# EAGLE design openSX70_ALADDIN_V37_20180120 (EAGLE 8.5.1)
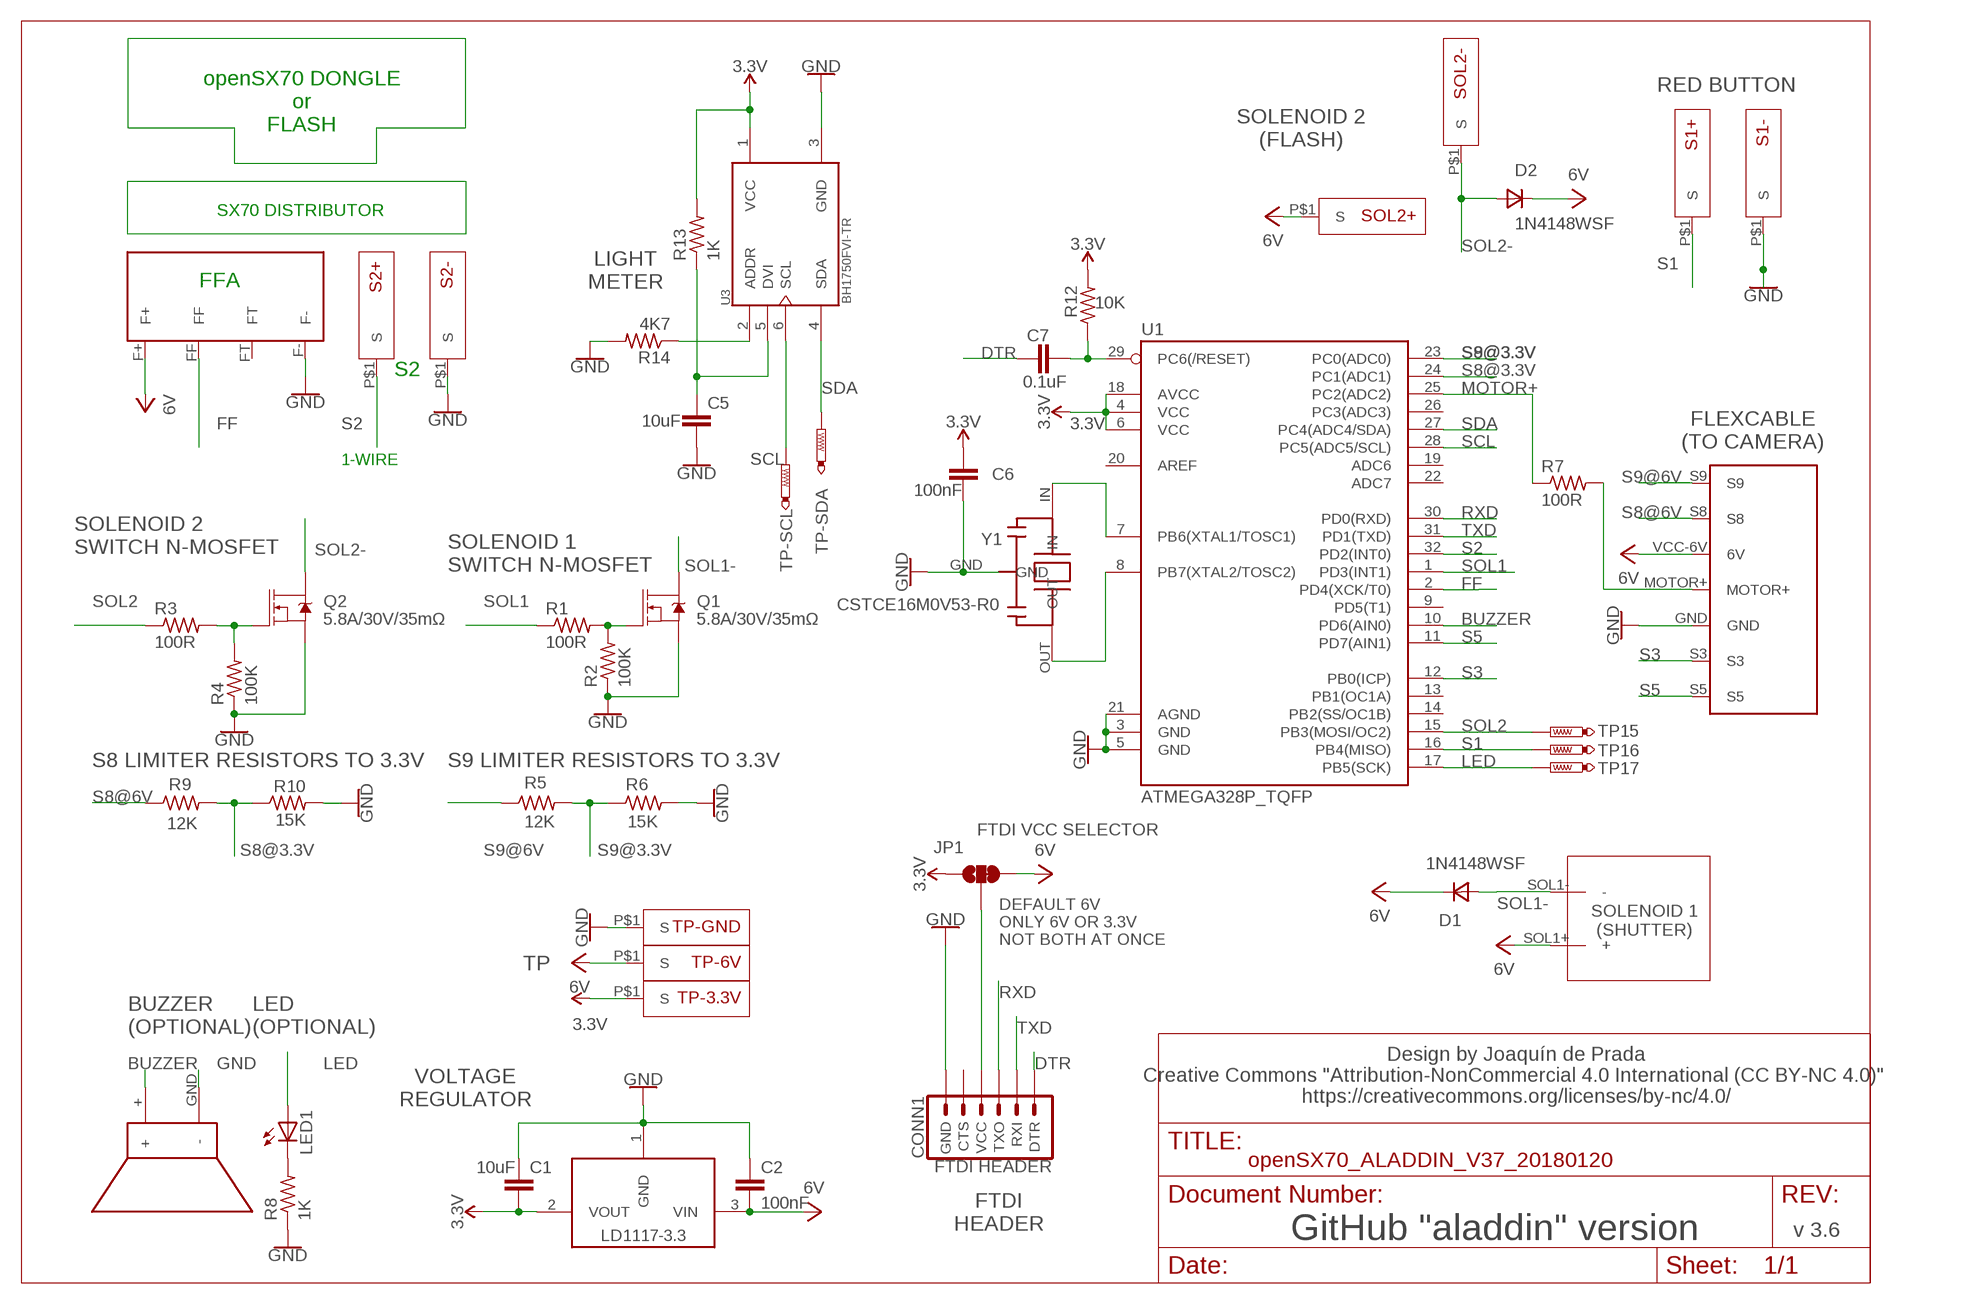
[diagram p0: schematic, sheet 1]

## Parts
BUZZ1  CSET8-5G  [CSET8-5G_PACKAGE]
C1  10uF  10UF-0603-6.3V-20%  [0603]
C2  100nF  C-EUC0603K  [C0603K]
C5  10uF  10UF-0603-6.3V-20%  [0603]
C6  100nF  C-EUC0603  [C0603]
C7  0.1uF  0.1UF-0603-25V-(+80/-20%)  [0603]
CONN1  FTDI HEADER  6_PIN_SERIAL_TARGET  [1X06]
D1  1N4148WSF  DSOD323  [SOD323]
D2  1N4148WSF  DSOD323  [SOD323]
JP1  FTDI VCC SELECTOR  JUMPER-SMT_3_1-NC_TRACE_SILK  [SMT-JUMPER_3_1-NC_TRACE_SILK]
LD11173.3V  LD1117 3.3V  LD1117-3.3  [SOT223]
LED1  LEDCHIPLED_0805  [CHIPLED_0805]
Q1  5.8A/30V/35mΩ  MOSFET-NCH-AO3404A  [SOT23-3]
Q2  5.8A/30V/35mΩ  MOSFET-NCH-AO3404A  [SOT23-3]
R1  100R  R-US_R0603  [R0603]
R2  100K  R-US_R0603  [R0603]
R3  100R  R-US_R0603  [R0603]
R4  100K  R-US_R0603  [R0603]
R5  12K  R-US_R0603  [R0603]
R6  15K  R-US_R0603  [R0603]
R7  100R  R-US_R0603  [R0603]
R8  1K  R-US_R0603  [R0603]
R9  12K  R-US_R0603  [R0603]
R10  15K  R-US_R0603  [R0603]
R12  10K  R-US_R0603  [R0603]
R13  1K  R-US_R0603  [R0603]
R14  4K7  R-US_R0603  [R0603]
S1+  SX70-S-PAD-NEW  [SX70-S-PAD2]
S1-  SX70-S-PAD-NEW  [SX70-S-PAD2]
S2+  SX70-S-PAD-NEW  [SX70-S-PAD2]
S2-  SX70-S-PAD-NEW  [SX70-S-PAD2]
SOL1  SX70-SOLENOID1-2PADS  [SX70-SOLENOID1-2]
SOL2+  SX70-S-PAD-NEW  [SX70-S-PAD2]
SOL2-  SX70-S-PAD-NEW  [SX70-S-PAD2]
TP15  PTR1TP08R  [TP08R]
TP16  PTR1TP08R  [TP08R]
TP17  PTR1TP08R  [TP08R]
TP-3.3V  SX70-S-PAD-NEW  [SX70-S-PAD2]
TP-6V  SX70-S-PAD-NEW  [SX70-S-PAD2]
TP-GND  SX70-S-PAD-NEW  [SX70-S-PAD2]
TP-SCL  PTR1TP08R  [TP08R]
TP-SDA  PTR1TP08R  [TP08R]
U1  ATMEGA328P_TQFP  [TQFP32-08]
U3  BH1750FVI-TR  [SOTFL50P300X75-6N]
U$1  SX70-7-PAD  [SX70-7-PAD]
U$2  FFA  SX70-FFA-PAD  [FFA-PAD-PACKAGE]
Y1  CSTCE16M0V53-R0  [CFP95P160X100-3N]

## Nets
3.3V: C1.2 C6.1 JP1.1 LD11173.3V.2(VOUT) R12.2 R13.2 TP-3.3V.P$1(S) U1.4(VCC) U1.6(VCC) U1.18(AVCC) U3.1(VCC)
6V: C2.2 D1.1(C) D2.1(C) JP1.3 LD11173.3V.3(VIN) SOL1.SOL1+(+) SOL2+.P$1(S) TP-6V.P$1(S) U$1.VCC-6V(6V) U$2.F+
BUZZER: BUZZ1.+ U1.10(PD6(AIN0))
DTR: C7.1 CONN1.1(DTR)
FF: U1.2(PD4(XCK/T0)) U$2.FF
GND: BUZZ1.GND(-) C1.1 C2.1 C5.2 C6.2 CONN1.6(GND) LD11173.3V.1(GND) Q1.2(S) Q2.2(S) R2.1 R4.1 R6.2 R8.1 R10.2 R14.2 S1-.P$1(S) S2-.P$1(S) TP-GND.P$1(S) U1.3(GND) U1.5(GND) U1.21(AGND) U3.3(GND) U$1.GND U$2.F- Y1.GND
LED: LED1.A TP17.TP U1.17(PB5(SCK))
MOTOR+: R7.1 U1.25(PC2(ADC2))
MOTOR-HEADER: R7.2 U$1.MOTOR+
N$1: Q1.1(G) R1.2 R2.2
N$2: C5.1 R13.1 U3.5(DVI)
N$3: Q2.1(G) R3.2 R4.2
N$4: U1.7(PB6(XTAL1/TOSC1)) Y1.IN
N$5: LED1.C R8.2
N$6: U1.8(PB7(XTAL2/TOSC2)) Y1.OUT
N$9: C7.2 R12.1 U1.29(PC6(/RESET))
N$10: R14.1 U3.2(ADDR)
N$27: CONN1.4(VCC) JP1.2
RXD: CONN1.3(TXO) U1.30(PD0(RXD))
S1: S1+.P$1(S) TP16.TP U1.16(PB4(MISO))
S2: S2+.P$1(S) U1.32(PD2(INT0))
S3: U1.12(PB0(ICP)) U$1.S3
S5: U1.11(PD7(AIN1)) U$1.S5
S8@3.3V: R9.2 R10.1 U1.24(PC1(ADC1))
S8@6V: R9.1 U$1.S8
S9@3.3V: R5.2 R6.1 U1.23(PC0(ADC0))
S9@6V: R5.1 U$1.S9
SCL: TP-SCL.TP U1.28(PC5(ADC5/SCL)) U3.6(SCL)
SDA: TP-SDA.TP U1.27(PC4(ADC4/SDA)) U3.4(SDA)
SOL1: R1.1 U1.1(PD3(INT1))
SOL1-: D1.2(A) Q1.3(D) SOL1.SOL1-(-)
SOL2: R3.1 TP15.TP U1.15(PB3(MOSI/OC2))
SOL2-: D2.2(A) Q2.3(D) SOL2-.P$1(S)
TXD: CONN1.2(RXI) U1.31(PD1(TXD))
Unconnected: CONN1.5(CTS) U1.9(PD5(T1)) U1.13(PB1(OC1A)) U1.14(PB2(SS/OC1B)) U1.19(ADC6) U1.20(AREF) U1.22(ADC7) U1.26(PC3(ADC3)) U$2.FT

## Notes on the sheet
- RED BUTTON
- openSX70 DONGLE
  or
  FLASH
- SOLENOID 2
  (FLASH)
- SX70 DISTRIBUTOR
- LIGHT
  METER
- FFA
- S2
- FLEXCABLE
  (TO CAMERA)
- 1-WIRE
- SOLENOID 2
  SWITCH N-MOSFET
- SOLENOID 1
  SWITCH N-MOSFET
- S8 LIMITER RESISTORS TO 3.3V | S9 LIMITER RESISTORS TO 3.3V
- SOLENOID 1
  (SHUTTER)
- TP
- DEFAULT 6V
  ONLY 6V OR 3.3V
  NOT BOTH AT ONCE
- BUZZER
  (OPTIONAL)
- LED
  (OPTIONAL)
- Design by Joaquín de Prada
  Creative Commons "Attribution-NonCommercial 4.0 International (CC BY-NC 4.0)" 
  https://creativecommons.org/licenses/by-nc/4.0/
- VOLTAGE
  REGULATOR
- FTDI
  HEADER
- v 3.6
- GitHub "aladdin" version

## Library data of the parts
BUZZ1 = openSX70:CSET8-5G
C1 C5 = SparkFun-Capacitors:10UF: 10.0µF ceramic capacitors A capacitor is a passive two-terminal electrical component used to store electrical energy temporarily in an electric field.; PROD_ID: CAP-11015
C2 C6 = rcl:C-EU: CAPACITOR, European symbol; SPICEPREFIX: C
C7 = SparkFun-Capacitors:0.1UF: 0.1µF ceramic capacitors A capacitor is a passive two-terminal electrical component used to store electrical energy temporarily in an electric field.; PROD_ID: CAP-00810
CONN1 = SparkFun-Connectors:6_PIN_SERIAL_TARGET: 6-pin header connection for use with the "FTDI BASIC" pinout - TARGET SIDE. Also known as "Arduino Serial Program Header". It is used to mate with our FTDI Basic serial programmers using the Arduino IDE. Note, this device has "TARGET" in the name. It is intended to be used on a design that contains a target micro-controller that you wish to program. The "sister" device, named "CABLE" is inteneded to be used on a design that usually lives on the end of your USB cable and prvides the converter chip (FTDI232 or FTDI231x) to commnicate serial RX/TX. You can populate with some of these: Break Away Headers - Straight (PRT-00116) For reference (or to suit your programming needs) check out these designs: SparkFun FTDI Basic Breakout - 5V (DEV-09716) SparkFun FTDI Basic Breakout - 3.3V (DEV-09873) SparkFun FTDI SmartBasic (DEV-12935) SparkFun Beefy 3 - FTDI Basic Breakout (DEV-13746)
D1 D2 = zetex:D: DIODE; MPN: CDSOD323-T05C; OC_FARNELL: 1824860; OC_NEWARK: 79R6078
JP1 = SparkFun-Jumpers:JUMPER-SMT_3_1-NC_TRACE: Normally closed trace jumper (1 of 2 connections) This jumper has a trace between two pads so it's normally closed (NC). The other connection is normally open (NO). Use a razor knife to open the connection. For best results follow the IPC guidelines for cutting traces: Cutout at least 0.063 mm (0.005 in). Remove all loose material to clean up the cut area. Seal the cut with an approved epoxy. Reapply solder to reclose the connection, or to close the NO connection.
LD11173.3V = openSX70:LD1117-3.3; AVAILABILITY: Unavailable; DESCRIPTION: Sot223/Pkg 1-Amp 5-Volt Low Drop Out Voltage Regulatator; MF: Advanced Monolithic Systems; MP: AMS1117-5.0; PACKAGE: None; PRICE: None
LED1 = led:LED: LED OSRAM: - CHIPLED LG R971, LG N971, LY N971, LG Q971, LY Q971, LO R971, LY R971 LH N974, LH R974 LS Q976, LO Q976, LY Q976 LO Q996 - Hyper CHIPLED LW Q18S LB Q993, LB Q99A, LB R99A - SideLED LS A670, LO A670, LY A670, LG A670, LP A670 LB A673, LV A673, LT A673, LW A673 LH A674 LY A675 LS A676, LA A676, LO A676, LY A676, LW A676 LS A679, LY A679, LG A679 - Hyper Micro SIDELED® LS Y876, LA Y876, LO Y876, LY Y876 LT Y87S - SmartLED LW L88C, LW L88S LB L89C, LB L89S, LG L890 LS L89K, LO L89K, LY L89K LS L896, LA L896, LO L896, LY L896 - TOPLED LS T670, LO T670, LY T670, LG T670, LP T670 LSG T670, LSP T670, LSY T670, LOP T670, LYG T670 LG T671, LOG T671, LSG T671 LB T673, LV T673, LT T673, LW T673 LH T674 LS T676, LA T676, LO T676, LY T676, LB T676, LH T676, LSB T676, LW T676 LB T67C, LV T67C, LT T67C, LS T67K, LO T67K, LY T67K, LW E67C LS E67B, LA E67B, LO E67B, LY E67B, LB E67C, LV E67C, LT E67C LW T67C LS T679, LY T679, LG T679 LS T770, LO T770, LY T770, LG T770, LP T770 LB T773, LV T773, LT T773, LW T773 LH T774 LS E675, LA E675, LY E675, LS T675 LS T776, LA T776, LO T776, LY T776, LB T776 LHGB T686 LT T68C, LB T68C - Hyper Mini TOPLED® LB M676 - Mini TOPLED Santana® LG M470 LS M47K, LO M47K, LY M47K Source: http://www.osram.convergy.de LUXEON: - LUMILED® LXK2-PW12-R00, LXK2-PW12-S00, LXK2-PW14-U00, LXK2-PW14-V00 LXK2-PM12-R00, LXK2-PM12-S00, LXK2-PM14-U00 LXK2-PE12-Q00, LXK2-PE12-R00, LXK2-PE12-S00, LXK2-PE14-T00, LXK2-PE14-U00 LXK2-PB12-K00, LXK2-PB12-L00, LXK2-PB12-M00, LXK2-PB14-N00, LXK2-PB14-P00, LXK2-PB14-Q00 LXK2-PR12-L00, LXK2-PR12-M00, LXK2-PR14-Q00, LXK2-PR14-R00 LXK2-PD12-Q00, LXK2-PD12-R00, LXK2-PD12-S00 LXK2-PH12-R00, LXK2-PH12-S00 LXK2-PL12-P00, LXK2-PL12-Q00, LXK2-PL12-R00 Source: www.luxeon.com KINGBRIGHT: KA-3528ASYC Source: www.kingbright.com
Q1 Q2 = openSX70:MOSFET-NCH: N-channel MOSFETs Voltage controlled devices that allow control of high current outputs. SparkFun Products: SparkFun OpenScale <https://www.sparkfun.com/products/13261> SparkFun Digital Sandbox <https://www.sparkfun.com/products/12651> SparkFun Monster Moto Shield <https://www.sparkfun.com/products/10182> SparkFun MOSFET Power Controller <https://www.sparkfun.com/products/11214>; PROD_ID: TRANS-12988
R1-R10 R12-R14 = resistor:R-US_: RESISTOR, American symbol
S1+ S1- S2+ S2- SOL2+ SOL2- TP-3.3V TP-6V TP-GND = openSX70:SX70-S-PAD-NEW
SOL1 = openSX70:SX70-SOLENOID1-2PADS
TP15-TP17 TP-SCL TP-SDA = testpad:PTR1: TEST PIN
U1 = openSX70:ATMEGA328P_TQFP: Popular 328P in QFP Storefront component: ATmega328 - TQFP (COM-13448) Datasheet SparkFun Products SparkFun RedBoard - Programmed with Arduino (DEV-12757) Arduino Pro Mini 328 - 5V/16MHz (DEV-11113) Arduino Pro Mini 328 - 3.3V/8MHz (DEV-11114) SparkFun OpenLog (DEV-13712) SparkFun MicroView - OLED Arduino Module (DEV-12923) SparkFun Digital Sandbox (DEV-12651) SparkFun PicoBoard (WIG-11888) Arduino Fio (DEV-10116) LilyPad Arduino 328 Main Board (DEV-13342) SparkFun RedStick (DEV-13741) LilyPad MP3 (DEV-11013) LilyPad Arduino SimpleSnap (DEV-10941) SparkFun Stepoko (ROB-13899) SparkFun Geiger Counter (SEN-11345) SparkFun EL Sequencer (COM-12781) Arduino Pro 328 - 5V/16MHz (DEV-10915) CryptoCape (DEV-12773) SparkFun IR Thermometer Evaluation Board - MLX90614 (SEN-10740) SparkFun RedBot Mainboard (ROB-12097) Arduino Pro 328 - 3.3V/8MHz (DEV-10914) SparkFun Block for Intel® Edison - Arduino (DEV-13036) SparkFun Simon Says - Surface Mount Soldering Kit (KIT-10935) SparkFun 7-Segment Serial Display - Red (COM-11441) SparkFun 7-Segment Serial Display - White (COM-11629) SparkFun 7-Segment Serial Display - Yellow (COM-11443) SparkFun 7-Segment Serial Display - Kelly Green (COM-11440) SparkFun 7-Segment Serial Display - Blue (COM-11442) SparkFun OpenSegment Serial Display - 20mm (Blue) (COM-11647) SparkFun OpenSegment Serial Display - 20mm (Green) (COM-11646) SparkFun OpenSegment Serial Display - 20mm (White) (COM-11648) SparkFun OpenSegment Serial Display - 20mm (Red) (COM-11644) SparkFun OpenSegment Serial Display - 20mm (Yellow) (COM-11645) SparkFun OpenSegment Shield (DEV-13190); PROD_ID: IC-09069
U3 = openSX70:BH1750FVI-TR: Light to Digital Ambient Light Sensor Digital O/P 1lux to 65535lux 6-Pin WSOF Embossed T/R; AVAILABILITY: Good; DESCRIPTION: Light to Digital Ambient Light Sensor Digital O/P 1lux to 65535lux 6-Pin WSOF Embossed T/R; MF: Rohm; MP: BH1750FVI-TR; PACKAGE: SMD-6 Rohm; PRICE: 2.38 USD
U$1 = openSX70:SX70-7-PAD
U$2 = openSX70:SX70-FFA-PAD
Y1 = CSTCE16M0V53-R0:CSTCE16M0V53-R0: Ceramic Resonator 16MHz ±0.5% (Tol) ±0.3% (Stability) 15pF 40Ohm 3-Pin CSMD T/R; AVAILABILITY: Good; DESCRIPTION: Ceramic Resonator 16MHz ??0.5% (Tol) ??0.3% (Stability) 15pF 40Ohm 3-Pin CSMD T/R; MF: Murata; MP: CSTCE16M0V53-R0; PACKAGE: SMD-3 Murata; PRICE: 0.28 USD

## Board
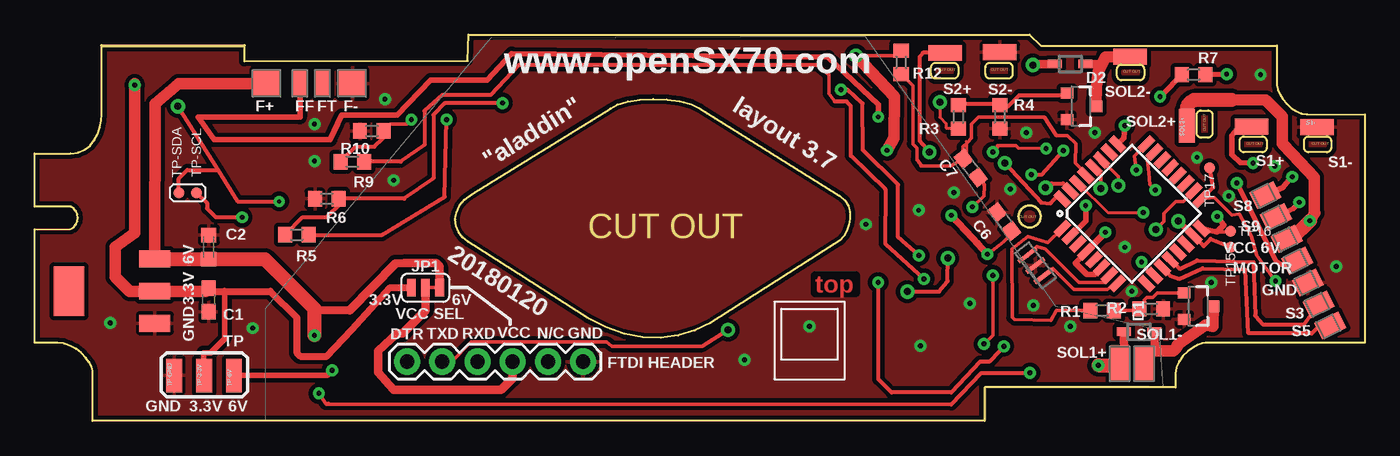
[diagram p1: board, top side]
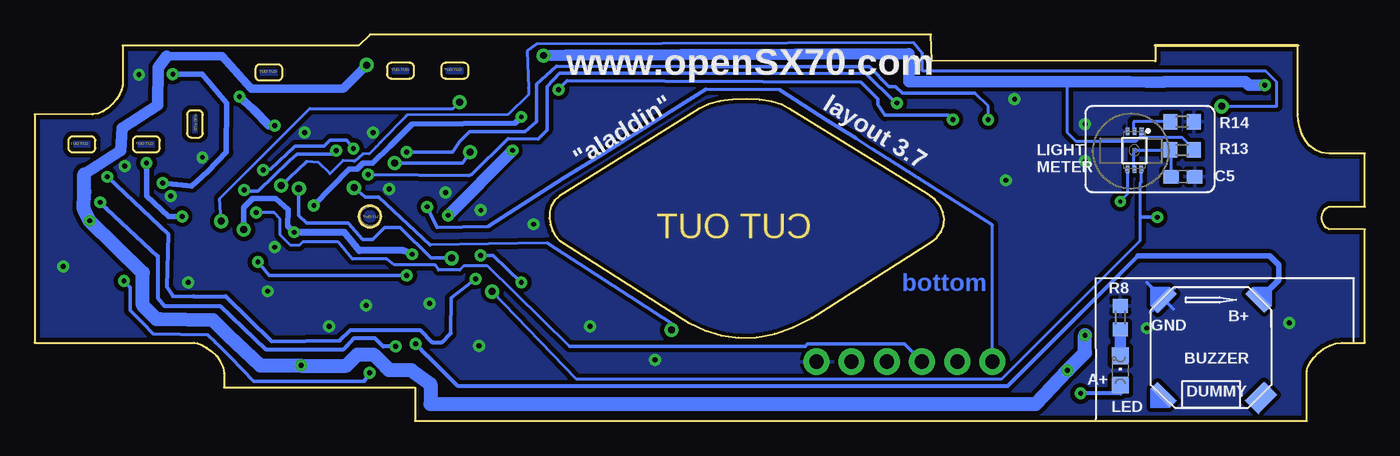
[diagram p2: board, bottom side, seen from below]

Size 95.88 x 27.86 mm. Coordinates in mm from the lower left corner, seen from the top.
Outline: 380 segments
Copper layers (1*16): Top 0.035mm / dielectric 1.5mm / Bottom 0.035mm
Design rules "SparkFun": minimum track width 8mil, minimum drill 20mil, track to track 8mil, track to pad 8mil, pad to pad 8mil, via to via 8mil, smd to smd 8mil, copper to edge 10mil, drill to drill 8mil, minimum pad ring 12mil, minimum via ring 10mil, stop-mask expansion 4mil, vias tented up to drill 25mil, thermal gap 10mil

### Footprints (pad centres in the part's own frame; a part is rotated, then mirrored left to right if it is on the bottom)
CSET8-5G_PACKAGE = smd 1.88 x 0.686 rotated 225: + 3.054,-3.114 | smd 1.88 x 0.686 rotated 45: DUMMY1 -3.786,3.746 | smd 1.9 x 1.3 rotated 135: DUMMY2 -3.99,-3.29 | smd 1.88 x 0.686 rotated 315: GND 3.051,3.742
0603 = smd 1.1 x 1: 1 -0.85,0; 2 0.85,0
C0603K = smd 1.05 x 1.08: 1 -0.875,0; 2 0.875,0
C0603 = smd 1.1 x 1: 1 -0.85,0; 2 0.85,0
1X06 = drill 1.016 pad 1.88: 1 0,0; 2 2.54,0; 3 5.08,0; 4 7.62,0; 5 10.16,0; 6 12.7,0
SOD323 = smd 1 x 0.6: 1 -1.1,0; 2 1.1,0
SMT-JUMPER_3_1-NC_TRACE_SILK = smd 0.635 x 1.27: 1 -1.016,0; 2 0,0; 3 1.016,0
SOT223 = smd 2.235 x 1.219: 1 -3.099,2.311; 2 -3.099,0; 3 -3.099,-2.311 | smd 2.2 x 3.6: 4 3.099,0
CHIPLED_0805 = smd 1.2 x 1.2: A 0,-1.05; C 0,1.05
SOT23-3 = smd 0.8 x 0.9: 1 -0.95,-1; 2 0.95,-1; 3 0,1.1
R0603 = smd 1 x 1.1: 1 -0.85,0; 2 0.85,0
SX70-S-PAD2 = smd 2.413 x 1.143: P$1 0.01,0.087
SX70-SOLENOID1-2 = smd 1.372 x 2.54: SOL1+ -0.826,0.127; SOL1- 0.953,0.127
TP08R = smd 0.8 x 0.8: TP 0,0
TQFP32-08 = smd 1.27 x 0.559: 1 -4.293,2.8; 2 -4.293,2; 3 -4.293,1.2; 4 -4.293,0.4; 5 -4.293,-0.4; 6 -4.293,-1.2; 7 -4.293,-2; 8 -4.293,-2.8; 17 4.293,-2.8; 18 4.293,-2; 19 4.293,-1.2; 20 4.293,-0.4; 21 4.293,0.4; 22 4.293,1.2; 23 4.293,2; 24 4.293,2.8 | smd 0.559 x 1.27: 9 -2.8,-4.293; 10 -2,-4.293; 11 -1.2,-4.293; 12 -0.4,-4.293; 13 0.4,-4.293; 14 1.2,-4.293; 15 2,-4.293; 16 2.8,-4.293; 25 2.8,4.293; 26 2,4.293; 27 1.2,4.293; 28 0.4,4.293; 29 -0.4,4.293; 30 -1.2,4.293; 31 -2,4.293; 32 -2.8,4.293
SOTFL50P300X75-6N = smd 0.55 x 0.3: 1 -1.375,0.525 | smd 0.55 x 0.25: 2 -1.375,0; 3 -1.375,-0.5; 4 1.375,-0.5; 5 1.375,0; 6 1.375,0.5
SX70-7-PAD = smd 1.31 x 1.93 rotated 296: GND 3.404,0.495; MOTOR+ 2.654,2.07; S3 4.204,-1.067; S5 5.016,-2.591; S8 0.356,6.807; S9 1.118,5.232; VCC-6V 1.88,3.658
FFA-PAD-PACKAGE = smd 1.95 x 1.95: F+ -3.277,-0.013; F- 2.87,0 | smd 1.05 x 1.95: FF -0.914,0; FT 0.737,0.025
CFP95P160X100-3N = smd 0.3 x 1.6: GND 0.038,0.175; IN -0.912,0.177; OUT 0.992,0.174

### Placement (x,y rotation side)
BUZZ1  10.77,5.67 90 bottom
C1  12.55,8.72 90 top
C2  12.55,12.53 270 top
C5  13.12,17.61 0 bottom
C6  69.89,14.37 128 top
C7  67.47,18.25 128 top
CONN1  26.83,4.28 0 top
D1  79.6,6.43 0 top
D2  74.65,25.74 0 top
JP1  28.17,9.61 0 top
LD11173.3V  5.56,9.36 180 top
LED1  17.63,3.64 0 bottom
Q1  83.86,8.28 270 top
Q2  75.41,22.69 270 top
R1  76.94,7.96 0 top
R2  80.49,8.09 180 top
R3  66.59,21.93 90 top
R4  69.57,21.93 90 top
R5  18.9,13.42 180 top
R6  21.06,16.02 180 top
R7  83.54,24.98 0 top
R8  17.63,7.45 270 bottom
R9  22.9,18.69 180 top
R10  24.29,20.91 180 top
R12  62.46,25.87 90 top
R13  13.18,19.55 0 bottom
R14  13.18,21.58 0 bottom
S1+  87.72,21.14 0 top
S1-  92.42,21.09 0 top
S2+  65.62,26.46 0 top
S2-  69.56,26.51 0 top
SOL1  79.03,4.05 0 top
SOL2+  83.14,21.28 90 top
SOL2-  78.96,26.19 0 top
TP15  86.21,12.53 0 top
TP16  86.21,13.67 90 top
TP17  84.68,18.25 0 top
TP-3.3V  12.29,3.26 90 top
TP-6V  14.45,3.26 90 top
TP-GND  10.13,3.26 90 top
TP-SCL  11.66,16.47 0 top
TP-SDA  10.39,16.47 0 top
U1  79.09,14.94 45 top
U3  16.61,19.52 270 bottom
U$1  88.37,9.48 0 top
U$2  20.04,24.34 0 top
Y1  71.98,11.13 308 top

### Tracks (layer width: path | path; a pad name or v marks a point on that pad's centre or on a via)
3.3V  (via drill 0.35, 0.5, 0.51)
  Top 0.203: 83.51,16.5 U1.18 | 70.33,13.8 C6.1
  Top 0.254: v80.81,13.8 81.38,14.37 81.38,14.94 82.27,15.83 82.81,15.83 83.51,16.5 | v59.19,26.36 62.1,26.36 R12.2 | 70.56,13.59 70.09,13.16 | 70.09,13.16 69.82,12.91 v68.68,12.02 | 70.09,13.16 70.41,13.48 C6.1 | C6.1
  Top 0.406: U1.4 75.03,11.39 75.86,10.56 76.41,10.56 U1.6 | 13.69,9.36 13.69,5.93 12.67,4.91 12.17,4.91 12.17,3.31 TP-3.3V.P$1
  Top 0.508: LD11173.3V.2 13.69,9.36 16.99,9.36 18.9,7.45 18.9,4.91 19.15,4.66 21.06,4.66 22.83,6.56 25.63,9.61 JP1.1 | U1.4 v77.19,13.6 v77.19,13.61 | v66.08,14.83 67.64,13.15 67.96,12.81 v68.68,12.02
  Top 0.813: 7.21,24.34 v7.21,24.21 7.21,13.55 5.82,12.53 5.82,10.37 6.83,9.36 LD11173.3V.2 12.33,9.36 C1.2 | v61.44,19.52 61.95,20.4 61.99,23.38 v59.19,26.36
  Bottom 0.203: 21.44,24.47 21.44,20.79 20.8,20.15 16.52,20.15 16.2,20.47 | U3.1 16.18,20.8 16.18,20.49 16.2,20.47 | R13.2 12.39,19.67 13.18,20.47 16.2,20.47 | 77.32,13.8 v77.19,13.61
  Bottom 0.406: v77.19,13.61 77.37,13.78 77.65,14.04 77.6,15.26 78.52,16.02 80.17,16.02 80.81,15.39 v80.81,13.8
  Bottom 0.508: v77.19,13.61 73.57,13.61 72.49,12.28 69.3,12.28 v68.68,12.02
  Bottom 0.813: v7.21,24.21 8.36,24.21 8.61,24.47 14.46,24.47 14.48,24.44 14.49,24.44 14.5,24.44 15.11,24.44 15.72,24.44 16.99,24.46 18.09,24.47 21.44,24.47 32.87,24.47 32.87,26.5 57.57,26.37 v59.19,26.36 | v61.44,19.52 v66.08,14.83
6V  (via drill 0.35, 0.51)
  Top 0.406: TP-6V.P$1 21.07,3.27 v21.44,3.64
  Top 0.559: 92.23,15.09 92.26,15
  Top 0.61: U$1.VCC-6V 90.63,13.14 | v71.95,25.68 arc-90 72.01,25.74 D2.1 | JP1.3 29.18,11.13 28.93,11.39 26.64,11.39 26.01,11.36 22.71,7.96 20.23,8.02 | 77.95,4.02 78.54,4.65 D1.1
  Top 0.813: U$2.F+ 10.39,24.34 8.67,22.88 LD11173.3V.3 | 20.17,8.09 20.23,8.02 | 92.23,15.09 92.23,17.56 92.26,17.56 90.65,19.23 89.93,20.01 89.93,21.93 88.75,23.14 86.27,23.17 | 92.26,15 v91.92,14.44
  Top 1.016: 90.63,13.14 v91.92,14.44 | v20.17,6.18 20.17,8.09 16.6,11.66 C2.2 LD11173.3V.3 | v76.68,4.01 77.95,4.02 SOL1.SOL1+ | SOL2+.P$1 83.05,22.42 arc-90 83.79,23.17 86.27,23.17
  Bottom 0.61: v71.95,25.68 73.67,23.96 80.27,23.96 82.36,26.31 86.37,26.31
  Bottom 0.813: 86.84,7.32 87.1,7.32 | 69.7,3.63 70.36,3.65 | 76.68,3.98 v76.68,4.01 | 86.37,26.31 86.97,25.48 87,22.79 89.57,21.13 89.7,19.52 92.3,17.8
  Bottom 1.016: 86.84,7.32 83.03,7.26 81.89,6.12 79.6,3.98 76.68,3.98 73.42,3.98 72.62,4.78 71.46,4.78 70.56,3.89 70.31,3.65 | 87.1,7.32 88.08,8.34 88.08,10.69 v91.92,14.44 92.33,15.26 92.3,16.53 92.3,17.8 | v20.17,6.18 20.17,4.91 v21.44,3.64 23.72,1.23 67.35,1.23 67.35,2.65 68.74,3.65 70.31,3.65 | 70.31,3.65 70.36,3.65
BUZZER  (via drill 0.35)
  Top 0.254: v68.43,5.55 69.06,6.18 v69.06,10.5 | 80.72,10.4 79.79,11.33 v79.79,11.45
  Top 0.305: U1.10 80.72,10.4
  Bottom 0.152: BUZZ1.+ 6.97,9.41
  Bottom 0.254: 79.6,11.27 v79.79,11.45 78.97,10.5 v69.06,10.5
  Bottom 0.305: 16.36,11.9 25.75,2.5 65.36,2.5 67.53,4.67 67.55,4.67 v68.43,5.55
  Bottom 0.406: BUZZ1.+ 6.2,10.18 6.2,11.26 6.83,11.9 16.36,11.9
DTR  (via drill 0.35)
  Top 0.203: C7.1 68.43,17.61 68.43,16.98 68.45,16.97
  Top 0.254: v67.59,15.44 68.42,16.22 68.45,16.97 68.45,17.04 68.02,17.59
  Bottom 0.203: CONN1.1 26.83,14.12 35.5,19.61 36.68,20.4
  Bottom 0.254: 36.68,20.4 38.74,21.68 42.2,23.9 47.5,23.93 55.17,19.12 57.77,17.53 63.19,14.02 66.87,13.96 v67.59,15.44
FF  (via drill 0.35)
  Top 0.406: 19.53,23.94 U$2.FF | v75.76,15.55 75.77,14.44 75.76,14.44 U1.2 | U$2.FF 19.15,24.32 | U$2.FF 19.13,21.9 11.78,21.93 12.93,20.28 21.31,20.28 22.14,22.06 26.14,22.06 28.55,24.6 32.61,24.6 34.39,26.5 57.19,26.25 60.81,22.82 v60.81,21.93
  Bottom 0.406: v60.81,21.93 61.27,21.48 68.68,21.42 69.8,20.28 69.87,20.21 70.27,19.83 71.51,18.6 72.2,18.6 72.66,18.15 73.22,18.15 v75.76,15.55
GND  (via drill 0.35)
  Bottom 0.254: 15.47,7.83 13.69,9.61 BUZZ1.GND 15.72,9.99 13.82,8.09
  other vias: 78.59,12.53 79.09,9.36 84.81,9.99 93.83,11.13 66.27,16.47 71.47,20.79 55.85,6.82 51.15,4.4 15.72,6.69 25.88,17.36 25.25,23.2 20.17,18.75 71.98,8.34 59.92,14.18 67.41,8.47 20.17,21.42 5.43,7.07 76.43,20.79 83.79,19.01 88.37,24.98 89.38,18.37 63.73,15.2 70.33,16.72 86.08,16.21 63.85,5.42 74.65,6.82
  pour Top (isolate 0.305): 91.7,22.11 91.77,22.11 95.88,22.11 95.88,5.64 84.4,5.64 84.15,5.6 83.83,5.47 83.48,5.27 83.11,5.01 82.78,4.68 82.5,4.3 82.31,3.87 82.24,3.4 82.24,2.41 68.47,2.41 68.47,0 4.17,0 4.17,3.6 4.11,3.9 3.94,4.23 3.69,4.56 3.36,4.89 2.98,5.18 2.56,5.42 2.11,5.58 1.66,5.64 0,5.64 0,13.82 2.59,13.84 2.81,13.96 2.98,14.15 3.07,14.39 3.1,14.65 3.07,14.91 2.97,15.15 2.81,15.34 2.59,15.45 0,15.46 0,19.29 2.59,19.29 3.14,19.36 3.6,19.56 3.99,19.87 4.3,20.25 4.53,20.7 4.7,21.17 4.79,21.65 4.82,22.11 4.82,27.07 15.1,27.07 15.1,25.94 31.21,25.85 31.28,27.86 71.71,27.86 72.52,27.07 89.55,27.07 89.55,24.21 89.61,23.9 89.76,23.56 89.97,23.21 90.25,22.87 90.57,22.57 90.93,22.33 91.31,22.17
  pour Bottom (isolate 0.305): 91.7,22.11 91.77,22.11 95.88,22.11 95.88,5.64 84.4,5.64 84.15,5.6 83.83,5.47 83.48,5.27 83.11,5.01 82.78,4.68 82.5,4.3 82.31,3.87 82.24,3.4 82.24,2.41 68.47,2.41 68.47,0 4.17,0 4.17,3.6 4.11,3.9 3.94,4.23 3.69,4.56 3.36,4.89 2.98,5.18 2.56,5.42 2.11,5.58 1.66,5.64 0,5.64 0,13.82 2.59,13.84 2.81,13.96 2.98,14.15 3.07,14.39 3.1,14.65 3.07,14.91 2.97,15.15 2.81,15.34 2.59,15.45 0,15.46 0,19.29 2.59,19.29 3.14,19.36 3.6,19.56 3.99,19.87 4.3,20.25 4.53,20.7 4.7,21.17 4.79,21.65 4.82,22.11 4.82,27.07 15.1,27.07 14.98,25.69 31.08,25.85 31.28,27.86 71.71,27.86 72.52,27.07 89.55,27.07 89.55,24.21 89.61,23.9 89.76,23.56 89.97,23.21 90.25,22.87 90.57,22.57 90.93,22.33 91.31,22.17
LED  (via drill 0.35)
  Top 0.254: U1.17 85.03,16.09 86.3,14.85 86.85,14.92 87.7,13.33 88.11,11.93 v89.45,10.09
  Top 0.305: v20.48,1.98 20.99,1.25 21.18,1.24 66.08,1.19 68.24,3.45 v71.75,3.46 | TP17.TP 84.94,16.83 U1.17
  Bottom 0.254: v71.75,3.46 72.12,2.87 80.1,2.87 81.76,4.57 82.66,5.47 82.88,5.68 83.41,6.22 87.35,6.28 88.11,7.07 89,7.96 89,9.64 v89.45,10.09
  Bottom 0.305: LED1.A 17.6,1.98 v20.48,1.98
MOTOR+  (via drill 0.35)
  Top 0.406: U1.25 78.52,20.4 78.59,21.23 v78.59,21.29 | v81.13,23.39 81.29,23.54 R7.1
  Bottom 0.406: v78.59,21.29 78.97,21.29
  Bottom 0.61: 78.97,21.29 80.11,22.44 v81.13,23.39
MOTOR-HEADER  (via drill 0.35)
  Top 0.406: U$1.MOTOR+ 91.03,11.51 90.14,11.13 89.51,11.51 v86.65,17.17 | v85.92,25.01 R7.2
  Bottom 0.406: v85.92,25.01 83.83,25.01 82.05,22.91 82.08,19.39 83.41,17.99 84.56,16.94 v86.65,17.17
N$1
  Top 0.254: R1.2 79.51,7.96 R2.2 79.98,8.43 79.98,8.72 80.17,8.91 80.6,8.91 80.91,9.23 Q1.1
N$2
  Bottom 0.203: U3.5 16.67,18.25 16.67,19.52 14.13,19.52 R13.1 13.98,19.52 C5.1
N$3
  Top 0.203: 74.3,23.48 Q2.1 | 69.7,22.69 R4.2 69.54,22.85 | 66.68,22.85 R3.2
  Top 0.305: 74.3,23.48 70.97,23.48 70.17,22.69 69.7,22.69 | 69.54,22.85 66.68,22.85
N$4
  Top 0.203: Y1.IN 71.6,11.9 71.54,11.96
  Top 0.254: U1.7 77.06,9.99 75.28,9.99 72.87,12.4 72.26,12.59 71.66,12.07 71.54,11.96 71.53,11.95
N$5
  Bottom 0.813: LED1.C R8.2
N$6
  Top 0.203: Y1.OUT 72.87,10.63 72.88,10.61
  Top 0.254: 77.95,9.93 77.32,9.48 74.9,9.48 73.38,11.01 72.88,10.61 72.75,10.49
  Top 0.305: U1.8 77.95,9.93 77.89,9.93
N$7
  pour Top: 71.72,15.54 71.88,15.53 72.03,15.48 72.17,15.41 72.29,15.31 72.39,15.19 72.46,15.06 72.51,14.91 72.52,14.74 72.51,14.58 72.46,14.43 72.39,14.3 72.29,14.18 72.17,14.08 72.03,14.01 71.88,13.96 71.72,13.94 71.56,13.96 71.41,14.01 71.28,14.08 71.16,14.18 71.06,14.3 70.99,14.43 70.94,14.58 70.92,14.74 70.94,14.91 70.99,15.06 71.06,15.19 71.16,15.31 71.28,15.41 71.41,15.48 71.56,15.53
N$8
  pour Top: 83.76,20.77 83.76,22.06 83.77,22.12 83.79,22.19 83.82,22.24 83.86,22.29 83.91,22.33 83.96,22.36 84.03,22.38 84.09,22.39 84.57,22.39 84.64,22.38 84.7,22.36 84.76,22.33 84.81,22.29 84.85,22.24 84.88,22.19 84.9,22.12 84.9,22.06 84.9,20.77 84.9,20.7 84.88,20.64 84.85,20.58 84.81,20.53 84.76,20.49 84.7,20.46 84.64,20.44 84.57,20.44 84.09,20.44 84.03,20.44 83.96,20.46 83.91,20.49 83.86,20.53 83.82,20.58 83.79,20.64 83.77,20.7
N$9
  Top 0.203: C7.2 67.16,18.88 67.16,20.15 67.22,20.09
  Top 0.254: U1.29 75.86,17.77 75.03,18.6 75.05,20.01 74.44,20.56 73.67,20.56 72.78,21.93 68.05,21.93 67.54,21.42 67.54,20.4 67.22,20.09 66.9,19.77 66.93,18.9 66.01,18.37 63.91,18.4 | R12.1 63.29,24.18 63.29,19.97 63.6,19.67 63.6,18.84
  Top 0.305: 63.6,18.84 63.91,18.4
N$10
  Bottom 0.203: R14.1 16.67,21.58 16.67,20.94 U3.2
N$11
  pour Top: 87.19,20.53 88.48,20.53 88.54,20.52 88.61,20.5 88.66,20.47 88.71,20.43 88.75,20.38 88.78,20.32 88.8,20.26 88.81,20.19 88.81,19.71 88.8,19.65 88.78,19.59 88.75,19.53 88.71,19.48 88.66,19.44 88.61,19.41 88.54,19.39 88.48,19.38 87.19,19.38 87.12,19.39 87.06,19.41 87,19.44 86.95,19.48 86.91,19.53 86.88,19.59 86.86,19.65 86.86,19.71 86.86,20.19 86.86,20.26 86.88,20.32 86.91,20.38 86.95,20.43 87,20.47 87.06,20.5 87.12,20.52
N$12
  pour Top: 91.84,20.53 93.13,20.53 93.2,20.52 93.26,20.5 93.32,20.47 93.37,20.43 93.41,20.38 93.44,20.32 93.46,20.26 93.46,20.19 93.46,19.71 93.46,19.65 93.44,19.59 93.41,19.53 93.37,19.48 93.32,19.44 93.26,19.41 93.2,19.39 93.13,19.38 91.84,19.38 91.78,19.39 91.71,19.41 91.66,19.44 91.61,19.48 91.57,19.53 91.54,19.59 91.52,19.65 91.51,19.71 91.51,20.19 91.52,20.26 91.54,20.32 91.57,20.38 91.61,20.43 91.66,20.47 91.71,20.5 91.78,20.52
N$13
  pour Top: 78.36,25.71 79.65,25.71 79.71,25.7 79.78,25.68 79.83,25.65 79.88,25.61 79.92,25.56 79.95,25.5 79.97,25.44 79.98,25.37 79.98,24.9 79.97,24.83 79.95,24.77 79.92,24.71 79.88,24.66 79.83,24.62 79.78,24.59 79.71,24.57 79.65,24.56 78.36,24.56 78.29,24.57 78.23,24.59 78.17,24.62 78.12,24.66 78.08,24.71 78.05,24.77 78.03,24.83 78.02,24.9 78.02,25.37 78.03,25.44 78.05,25.5 78.08,25.56 78.12,25.61 78.17,25.65 78.23,25.68 78.29,25.7
N$14
  pour Top: 68.87,25.84 70.16,25.84 70.23,25.83 70.29,25.81 70.35,25.78 70.39,25.74 70.44,25.69 70.47,25.63 70.49,25.57 70.49,25.5 70.49,25.03 70.49,24.96 70.47,24.9 70.44,24.84 70.39,24.79 70.35,24.75 70.29,24.72 70.23,24.7 70.16,24.69 68.87,24.69 68.8,24.7 68.74,24.72 68.69,24.75 68.64,24.79 68.6,24.84 68.56,24.9 68.55,24.96 68.54,25.03 68.54,25.5 68.55,25.57 68.56,25.63 68.6,25.69 68.64,25.74 68.69,25.78 68.74,25.81 68.8,25.83
N$16
  pour Top: 64.95,25.84 66.24,25.84 66.31,25.83 66.37,25.81 66.43,25.78 66.48,25.74 66.52,25.69 66.55,25.63 66.57,25.57 66.57,25.5 66.57,25.03 66.57,24.96 66.55,24.9 66.52,24.84 66.48,24.79 66.43,24.75 66.37,24.72 66.31,24.7 66.24,24.69 64.95,24.69 64.89,24.7 64.82,24.72 64.77,24.75 64.72,24.79 64.68,24.84 64.65,24.9 64.63,24.96 64.62,25.03 64.62,25.5 64.63,25.57 64.65,25.63 64.68,25.69 64.72,25.74 64.77,25.78 64.82,25.81 64.89,25.83
N$17
  pour Top: 31.52,16.35 41.5,22.53 42.01,22.82 42.74,23.03 43.62,23.16 44.59,23.21 45.57,23.18 46.5,23.05 47.32,22.84 47.96,22.53 58.05,16.23 58.41,15.9 58.64,15.51 58.77,15.07 58.78,14.61 58.71,14.16 58.56,13.73 58.34,13.34 58.06,13.03 49.78,7.76 48.71,7.05 47.57,6.51 46.38,6.16 45.13,5.99 43.85,6.03 42.53,6.28 41.2,6.75 39.87,7.45 31.22,12.93 30.83,13.23 30.55,13.62 30.37,14.06 30.32,14.55 30.4,15.04 30.62,15.52 30.99,15.97
N$18
  pour Bottom: 71.72,15.54 71.88,15.53 72.03,15.48 72.17,15.41 72.29,15.31 72.39,15.19 72.46,15.06 72.51,14.91 72.52,14.74 72.51,14.58 72.46,14.43 72.39,14.3 72.29,14.18 72.17,14.08 72.03,14.01 71.88,13.96 71.72,13.94 71.56,13.96 71.41,14.01 71.28,14.08 71.16,14.18 71.06,14.3 70.99,14.43 70.94,14.58 70.92,14.74 70.94,14.91 70.99,15.06 71.06,15.19 71.16,15.31 71.28,15.41 71.41,15.48 71.56,15.53
N$19
  pour Bottom: 83.76,20.77 83.76,22.06 83.77,22.12 83.79,22.19 83.82,22.24 83.86,22.29 83.91,22.33 83.96,22.36 84.03,22.38 84.09,22.39 84.57,22.39 84.64,22.38 84.7,22.36 84.76,22.33 84.81,22.29 84.85,22.24 84.88,22.19 84.9,22.12 84.9,22.06 84.9,20.77 84.9,20.7 84.88,20.64 84.85,20.58 84.81,20.53 84.76,20.49 84.7,20.46 84.64,20.44 84.57,20.44 84.09,20.44 84.03,20.44 83.96,20.46 83.91,20.49 83.86,20.53 83.82,20.58 83.79,20.64 83.77,20.7
N$20
  pour Bottom: 87.19,20.53 88.48,20.53 88.54,20.52 88.61,20.5 88.66,20.47 88.71,20.43 88.75,20.38 88.78,20.32 88.8,20.26 88.81,20.19 88.81,19.71 88.8,19.65 88.78,19.59 88.75,19.53 88.71,19.48 88.66,19.44 88.61,19.41 88.54,19.39 88.48,19.38 87.19,19.38 87.12,19.39 87.06,19.41 87,19.44 86.95,19.48 86.91,19.53 86.88,19.59 86.86,19.65 86.86,19.71 86.86,20.19 86.86,20.26 86.88,20.32 86.91,20.38 86.95,20.43 87,20.47 87.06,20.5 87.12,20.52
N$21
  pour Bottom: 91.84,20.53 93.13,20.53 93.2,20.52 93.26,20.5 93.32,20.47 93.37,20.43 93.41,20.38 93.44,20.32 93.46,20.26 93.46,20.19 93.46,19.71 93.46,19.65 93.44,19.59 93.41,19.53 93.37,19.48 93.32,19.44 93.26,19.41 93.2,19.39 93.13,19.38 91.84,19.38 91.78,19.39 91.71,19.41 91.66,19.44 91.61,19.48 91.57,19.53 91.54,19.59 91.52,19.65 91.51,19.71 91.51,20.19 91.52,20.26 91.54,20.32 91.57,20.38 91.61,20.43 91.66,20.47 91.71,20.5 91.78,20.52
N$22
  pour Bottom: 78.36,25.71 79.65,25.71 79.71,25.7 79.78,25.68 79.83,25.65 79.88,25.61 79.92,25.56 79.95,25.5 79.97,25.44 79.98,25.37 79.98,24.9 79.97,24.83 79.95,24.77 79.92,24.71 79.88,24.66 79.83,24.62 79.78,24.59 79.71,24.57 79.65,24.56 78.36,24.56 78.29,24.57 78.23,24.59 78.17,24.62 78.12,24.66 78.08,24.71 78.05,24.77 78.03,24.83 78.02,24.9 78.02,25.37 78.03,25.44 78.05,25.5 78.08,25.56 78.12,25.61 78.17,25.65 78.23,25.68 78.29,25.7
N$23
  pour Bottom: 68.87,25.84 70.16,25.84 70.23,25.83 70.29,25.81 70.35,25.78 70.39,25.74 70.44,25.69 70.47,25.63 70.49,25.57 70.49,25.5 70.49,25.03 70.49,24.96 70.47,24.9 70.44,24.84 70.39,24.79 70.35,24.75 70.29,24.72 70.23,24.7 70.16,24.69 68.87,24.69 68.8,24.7 68.74,24.72 68.69,24.75 68.64,24.79 68.6,24.84 68.56,24.9 68.55,24.96 68.54,25.03 68.54,25.5 68.55,25.57 68.56,25.63 68.6,25.69 68.64,25.74 68.69,25.78 68.74,25.81 68.8,25.83
N$24
  pour Bottom: 64.95,25.84 66.24,25.84 66.31,25.83 66.37,25.81 66.43,25.78 66.48,25.74 66.52,25.69 66.55,25.63 66.57,25.57 66.57,25.5 66.57,25.03 66.57,24.96 66.55,24.9 66.52,24.84 66.48,24.79 66.43,24.75 66.37,24.72 66.31,24.7 66.24,24.69 64.95,24.69 64.89,24.7 64.82,24.72 64.77,24.75 64.72,24.79 64.68,24.84 64.65,24.9 64.63,24.96 64.62,25.03 64.62,25.5 64.63,25.57 64.65,25.63 64.68,25.69 64.72,25.74 64.77,25.78 64.82,25.81 64.89,25.83
N$25
  pour Bottom: 31.52,16.35 41.5,22.53 42.01,22.82 42.74,23.03 43.62,23.16 44.59,23.21 45.57,23.18 46.5,23.05 47.32,22.84 47.96,22.53 58.05,16.23 58.41,15.9 58.64,15.51 58.77,15.07 58.78,14.61 58.71,14.16 58.56,13.73 58.34,13.34 58.06,13.03 49.78,7.76 48.71,7.05 47.57,6.51 46.38,6.16 45.13,5.99 43.85,6.03 42.53,6.28 41.2,6.75 39.87,7.45 31.22,12.93 30.83,13.23 30.55,13.62 30.37,14.06 30.32,14.55 30.4,15.04 30.62,15.52 30.99,15.97
N$27
  Top 0.61: JP1.2 28.17,7.96 26.52,6.31 26.14,6.31 24.74,5.04 24.74,3.51 25.88,2.24 33.63,2.24 34.45,3.07 CONN1.4
RXD  (via drill 0.35)
  Top 0.203: U1.30 75.32,17.04 77.36,15.03 v79.92,15.04
  Bottom 0.203: 57.31,5.39 63.22,11.17 64.97,11.17 65.25,10.88 66.78,10.88 67.03,11.26 69.95,11.26 70.49,11.67 73,11.67 74.01,12.91 76.55,12.91 76.81,12.66 77.44,12.66 78.21,13.42 78.21,14.56 78.64,15.01 v79.92,15.04 | 40.17,5.55 40.33,5.39
  Bottom 0.254: 40.33,5.39 57.31,5.39 | 40.17,5.55 33.18,5.55 CONN1.3
S1  (via drill 0.35)
  Top 0.305: U1.16 85.22,13.63 TP16.TP
  Top 0.406: v87.83,18.59 86.9,18.63 86.3,19.2 86.3,20.56 86.84,21.23 S1+.P$1 | v85.25,14.75 85.7,14.14 85.2,13.63 U1.16
  Bottom 0.406: v87.83,18.59 87.83,16.21 86.21,14.75 v85.25,14.75
S2  (via drill 0.51)
  Top 0.203: 73.8,16.29 U1.32
  Top 0.305: S2+.P$1 64.03,26.55 63.79,26.24 63.79,20.21 v64.49,19.39 | 73.8,16.29 73.46,15.96 73.21,15.68 72.55,15.74 v69.95,18.59
  Bottom 0.254: v69.95,18.59 65.03,18.59 v64.49,19.39
S3
  Top 0.305: U1.12 82.56,10.97 83.79,11.58 87.86,11.45 87.98,7.58 88.52,6.97 91.51,6.97 U$1.S3
S5
  Top 0.305: 93.38,6.68 U$1.S5 | 92.56,6.89 U$1.S5 | U$1.S5 92.63,6.89 92.05,6.31 87.49,6.33 87.25,10.91 84.17,11.01 82.52,10.24 81.82,10.5 U1.11
S8@3.3V  (via drill 0.35)
  Top 0.254: U1.24 79.29,19.1 v79.41,18.09 | 25.1,20.86 25.13,20.9 R10.1 25.65,21.42 26.83,21.42 v27.15,21.74 | v72.91,19.65 70.9,19.67 70.71,19.86 69.41,19.86 69.35,19.42 v69.06,19.39
  Top 0.305: R9.2 23.13,19.77 24.48,19.77 25.13,20.42 25.13,20.9
  Bottom 0.203: 48.3,25.55 49.06,25.55 | v27.15,21.74 27.15,22.69 28.1,23.64
  Bottom 0.254: v79.41,18.09 78.87,18.16 77.1,19.83 76.84,19.83 75.01,19.83 74.57,20.27 73.38,20.26 v72.91,19.65 | v69.06,19.39 65.76,19.39 65.25,20.15 64.53,20.86 60.52,20.88 59.7,21.58 59.7,24.28 58.27,25.58 48.3,25.55 35.72,25.55 34.3,24.12 33.82,24.12 33.34,23.64 28.1,23.64
S8@6V  (via drill 0.35)
  Top 0.254: 57.69,23.03 57.24,23.6 57.24,24.99
  Top 0.305: v64.11,10.24 61.3,12.81 61.31,16.72 58.84,19.13 58.84,22.72 58.53,23.03 57.69,23.03 | R9.1 26.39,18.69 28.1,19.9 28.1,22.37 29.37,23.52 32.87,23.52 34.87,25.64 56.42,25.64 57.24,24.99
  Top 0.406: U$1.S8 89.95,16.85 90.4,17.36 v90.65,17.61
  Bottom 0.254: 65.89,6.31 65.88,8.85 v64.11,10.24
  Bottom 0.305: v90.65,17.61 86.27,13.48 86.37,9.67 85.92,9 84.45,8.98 82.12,8.98 78.81,5.74 73.89,5.8 73.13,6.56 68.11,6.56 67.22,5.67 66.52,5.67 65.89,6.31
S9@3.3V  (via drill 0.35)
  Top 0.254: U1.23 80.72,19.37 80.2,18.85 80.32,17.88 80.4,17.04 v80.78,16.66 | v33.72,22.93 33.44,22.91
  Top 0.305: 33.44,22.91 29.56,22.91 28.74,22.08 28.74,17.48 26.64,16.02 22.08,16.03 | 22.08,16.03 R6.1 | v74.14,19.51 72.61,17.78 v71.86,17.77 | R5.2 19.32,14.69 21.06,14.69 22.08,15.71 22.08,16.03
  Bottom 0.203: v33.72,22.93 33.88,23.01
  Bottom 0.254: v80.78,16.66 80.63,16.58 79.79,16.58 77.49,18.79 76.95,19.23 76.43,19.24 74.29,19.24 v74.14,19.51 | v71.86,17.77 64.62,17.71 64.39,17.76 61.76,20.37 59.6,20.33 58.96,20.98 58.96,24.13 58.04,25.07 48.56,25.07 35.98,25.04 33.88,23.01
S9@6V  (via drill 0.35)
  Top 0.254: 91.16,15.71 v91.16,15.77
  Top 0.305: v69.86,5.39 69.54,5 68.81,4.28 68.14,4.28 66.08,2.05 61.76,2.05 60.81,3.01 v60.81,9.99 | v63.75,11.93 62.24,13.25 62.24,17.04 59.7,19.55 59.68,22.89 58.58,23.89 v58.11,23.9 | R5.1 25.06,13.42 29.56,16.15 v29.69,21.74
  Top 0.406: U$1.S9 90.71,15.32 91.16,15.71
  Bottom 0.203: v29.69,21.74 30.01,22.06
  Bottom 0.254: v60.81,9.99 62.83,11.93 v63.75,11.93 | 30.01,22.06 34.58,22.06 35.09,22.82 35.09,23.2 36.32,24.43 57.5,24.53 v58.11,23.9
  Bottom 0.305: v91.16,15.77 90.71,15.32 87,11.86 87,8.88 86.54,8.3 84.77,8.28 82.52,8.28 79.22,5.16 73.6,5.16 73.37,5.42 72.85,5.98 71.38,5.98 70.76,5.37 v69.86,5.39
SCL  (via drill 0.35, 0.51)
  Top 0.203: 76.36,18.25 U1.28
  Top 0.254: 76.36,18.25 76.84,17.77 v76.84,16.75
  Top 0.305: v65.82,11.74 65.8,10.12 65.8,10.06 65.19,9.32 v62.9,9.32 | TP-SCL.TP 12.42,15.71 12.42,15.32 13.05,14.69 v14.96,14.69
  Bottom 0.203: v62.9,9.32 56.84,3.01 26.2,3.01 16.2,13.01 16.2,14.69 16.2,17.17 16.1,17.26 16.1,18.13 U3.6
  Bottom 0.254: v76.84,16.75 76.84,14.82 76.27,14.28 73.28,14.28 72.24,13.1 71.51,13.1 70.65,13.96 69.54,13.96 67.32,11.74 v65.82,11.74 | v14.96,14.69 16.2,14.69
SDA  (via drill 0.3, 0.51)
  Top 0.203: 77,18.72 U1.27
  Top 0.254: 77,18.72 78.11,17.61 v78.11,16.98
  Top 0.305: v10.32,22.69 13.22,18.09 | 13.22,18.09 14.64,15.83 v17.63,15.83 | TP-SDA.TP 10.39,17.48 11,18.09 13.22,18.09
  Bottom 0.203: v10.32,22.69 6.36,22.69 6.36,24.44 7.15,25.23 31.88,25.23 31.88,26.5 32.55,27.29 59.76,27.17 60.37,26.7 60.29,24 60.29,23.52 61.77,22.09 69.06,22.06 69.12,21.99 70.93,20.1 71.28,19.76 71.74,19.27 72.24,19.26 72.83,18.73 72.93,18.75 73.67,18.79 74.59,17.83 75.41,18.63 76.27,18.69 | U3.4 17.11,16.38 17.66,15.83 v17.63,15.83
  Bottom 0.254: 76.27,18.69 v78.11,16.98
SOL1
  Top 0.254: U1.1 73.05,12.86 73,12.86 71.6,13.29 70.46,12.4 70.47,7.46 70.64,7.31 73.26,7.25 73.63,7.96 R1.1
SOL1-
  Top 0.61: D1.2 80.75,5.04
  Top 0.813: SOL1.SOL1- 79.98,5.04 80.75,5.04 82.07,5.04 82.26,5.23 82.36,5.36 82.38,5.36 82.38,5.49 84.43,6.91 84.94,6.82 Q1.3
SOL2  (via drill 0.51)
  Top 0.203: v65.25,23.01 65.25,21.9 65.7,21.45 65.7,21.13 66.52,21.1 R3.1 | 83.51,13.32 U1.15
  Top 0.305: U1.15 84.26,12.6 84.77,13.13 TP15.TP
  Top 0.406: 83.51,13.32 v82.43,14.4
  Bottom 0.203: v65.25,23.01 65.73,22.53 76.05,22.53 82.56,16.02 v82.43,14.4
SOL2-
  Top 0.152: 76.88,25.64 arc90 76.78,25.74
  Top 0.203: 76.36,22.69 Q2.3
  Top 0.305: 76.68,25.74 76.68,25.23
  Top 0.61: 76.78,25.74 D2.2
  Top 0.813: SOL2-.P$1 77.19,26.25 76.88,25.64 76.68,25.23 76.52,24.12 Q2.3
TXD  (via drill 0.51)
  Top 0.203: 74.62,16.66 U1.31
  Top 0.254: CONN1.2 30.05,4.28 31.47,5.7 41.22,5.7 41.63,5.39 48.11,5.39 v49.98,6.56
  Top 0.305: 74.62,16.66 74.14,17.13 73.3,17.13 v72.87,16.82
  Bottom 0.203: 67.38,12.69 58.93,12.82 49.98,7.04 v49.98,6.56
  Bottom 0.254: v72.87,16.82 72.08,16.15 71.09,16.15 67.38,12.69

### Text on the board
Top: top
Bottom: bottom
Dimension: CUT OUT | CUT OUT | CUT OUT | CUT OUT | CUT OUT | CUT OUT | CUT OUT | CUT OUT
tPlace: www.openSX70.com | www.openSX70.com | "aladdin" | S2+ | S2- | SOL2- | F+ | FF | FT | F- | layout 3.7 | SOL2+ | S1+ | S1- | S8 | S9 | 20180120 | VCC 6V | 6V | MOTOR | GND | 3.3V | S3 | GND | DTR | TXD | RXD | VCC | N/C | GND | SOL1- | S5 | TP | FTDI HEADER | SOL1+ | GND | 3.3V | 6V
bPlace: www.openSX70.com | "aladdin" | layout 3.7 | LIGHT / METER | BUZZER
tNames: 3.3V | 6V | VCC SEL
bNames: B+ | GND | DUMMY | A+ | LED
tDocu: Creative Commons "Attribution-NonCommercial 4.0 International (CC BY-NC 4.0)" / https://creativecommons.org/licenses/by-nc/4.0/ | ALL VIAS TENTED | openSX70 project visit www.openSX70.com / version 3.7 "aladdin" 20170120 / by Joaquín de Prada